# EAGLE schematic day 1 (EAGLE 9.6.2)
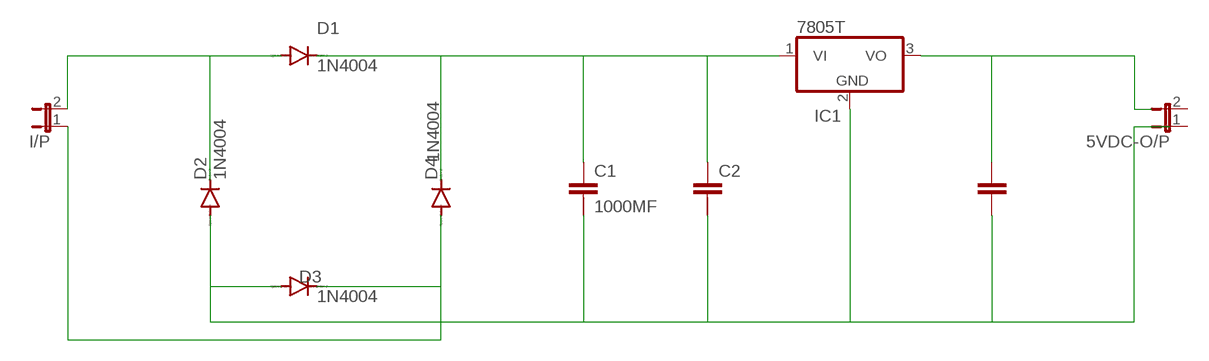
[diagram p0: schematic, sheet 1]

## Parts
5VDC-O/P  JP1E  [JP1]
C1  1000MF  C-2.5-5/2  [C2.5/5-2]
C2  C-2.5-5/2  [C2.5/5-2]
D1  1N4004  [DO41-10]
D2  1N4004  [DO41-10]
D3  1N4004  [DO41-10]
D4  1N4004  [DO41-10]
I/P  JP1E  [JP1]
IC1  7805T  [TO220H]

## Nets
N$1: D1.A D2.C I/P.2
N$2: C1.1 C2.1 D1.C D4.C IC1.1(VI)
N$3: D3.C D4.A I/P.1
N$4: C1.2 C2.2 D2.A D3.A IC1.2(GND)
N$5: IC1.3(VO)
Unconnected: 5VDC-O/P.1 5VDC-O/P.2 C1.3 C2.3

## Library data of the parts
5VDC-O/P I/P = jumper:JP1E: JUMPER
C1 C2 = capacitor-wima:C-: CAPACITOR for alternative placement naming: default grid - extended grid/package width
D1-D4 = diode:1N4004: DIODE general purpose rectifier, 1 A
IC1 = linear:78*: Positive VOLTAGE REGULATOR Source: http://cache.national.com/ds/LM/LM78L05.pdf http://www.fairchildsemi.com/ds/LM/LM7805.pdf